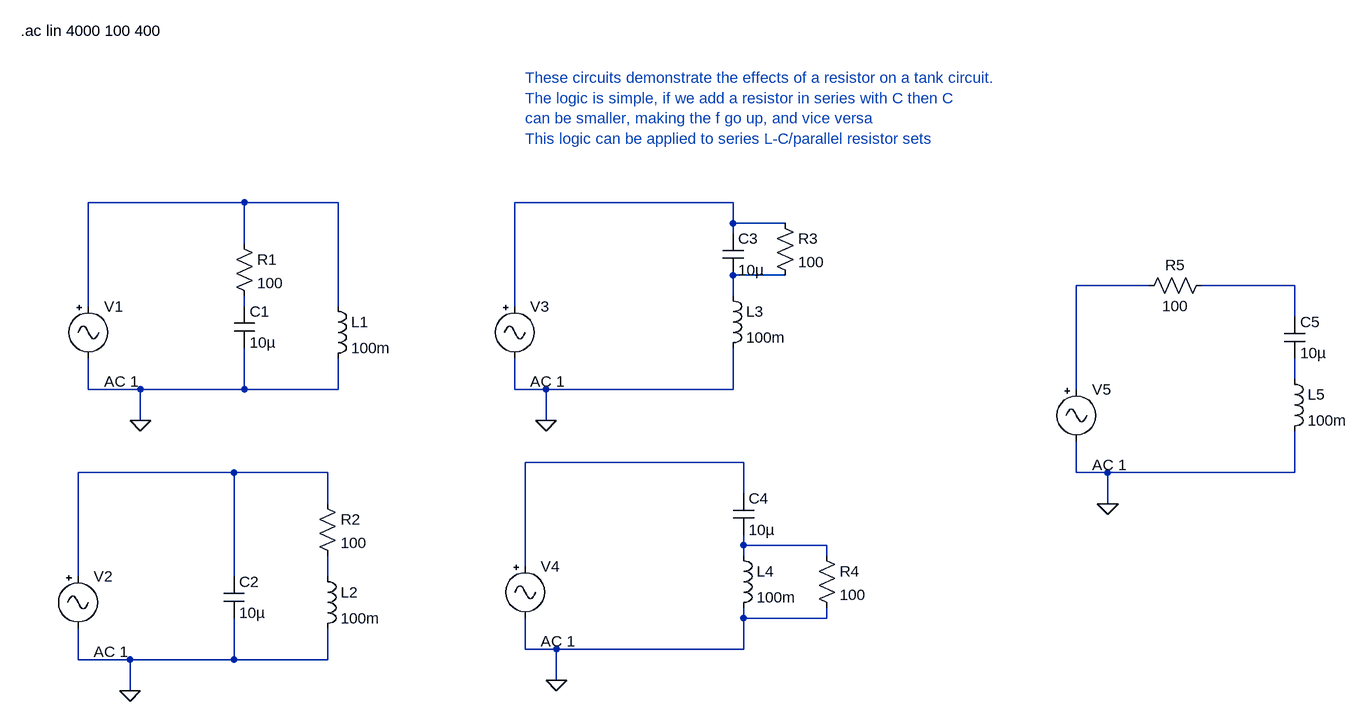
[diagram p0: schematic Antiresonance.asc]
Antiresonance.asc, the LTspice schematic file:
Version 4.1
SHEET 1 2084 724
WIRE 320 -48 80 -48
WIRE 464 -48 320 -48
WIRE 1072 -48 736 -48
WIRE 1072 -16 1072 -48
WIRE 1152 -16 1072 -16
WIRE 1072 0 1072 -16
WIRE 320 16 320 -48
WIRE 1152 64 1072 64
WIRE 1712 80 1600 80
WIRE 1936 80 1792 80
WIRE 1072 96 1072 64
WIRE 80 112 80 -48
WIRE 320 112 320 96
WIRE 464 112 464 -48
WIRE 736 112 736 -48
WIRE 1936 128 1936 80
WIRE 1936 224 1936 192
WIRE 80 240 80 192
WIRE 160 240 80 240
WIRE 320 240 320 176
WIRE 320 240 160 240
WIRE 464 240 464 192
WIRE 464 240 320 240
WIRE 736 240 736 192
WIRE 784 240 736 240
WIRE 1072 240 1072 176
WIRE 1072 240 784 240
WIRE 1600 240 1600 80
WIRE 160 288 160 240
WIRE 784 288 784 240
WIRE 1088 352 752 352
WIRE 304 368 64 368
WIRE 448 368 304 368
WIRE 1600 368 1600 320
WIRE 1648 368 1600 368
WIRE 1936 368 1936 304
WIRE 1936 368 1648 368
WIRE 1088 400 1088 352
WIRE 448 416 448 368
WIRE 1648 416 1648 368
WIRE 1088 480 1088 464
WIRE 1216 480 1088 480
WIRE 1088 496 1088 480
WIRE 1216 496 1216 480
WIRE 752 512 752 352
WIRE 64 528 64 368
WIRE 304 528 304 368
WIRE 448 528 448 496
WIRE 1088 592 1088 576
WIRE 1216 592 1216 576
WIRE 1216 592 1088 592
WIRE 752 640 752 592
WIRE 800 640 752 640
WIRE 1088 640 1088 592
WIRE 1088 640 800 640
WIRE 64 656 64 608
WIRE 144 656 64 656
WIRE 304 656 304 592
WIRE 304 656 144 656
WIRE 448 656 448 608
WIRE 448 656 304 656
WIRE 800 688 800 640
WIRE 144 704 144 656
FLAG 160 288 0
FLAG 144 704 0
FLAG 784 288 0
FLAG 800 688 0
FLAG 1648 416 0
SYMBOL cap 304 112 R0
SYMATTR InstName C1
SYMATTR Value 10µ
SYMBOL ind 448 96 R0
SYMATTR InstName L1
SYMATTR Value 100m
SYMATTR SpiceLine Rser=1u
SYMBOL res 304 0 R0
SYMATTR InstName R1
SYMATTR Value 100
SYMBOL cap 288 528 R0
SYMATTR InstName C2
SYMATTR Value 10µ
SYMATTR SpiceLine Rser=1u
SYMBOL ind 432 512 R0
SYMATTR InstName L2
SYMATTR Value 100m
SYMATTR SpiceLine Rser=0
SYMBOL res 432 400 R0
SYMATTR InstName R2
SYMATTR Value 100
SYMBOL res 1136 -32 R0
SYMATTR InstName R3
SYMATTR Value 100
SYMBOL cap 1056 0 R0
SYMATTR InstName C3
SYMATTR Value 10µ
SYMATTR SpiceLine Rser=1u
SYMBOL ind 1056 80 R0
SYMATTR InstName L3
SYMATTR Value 100m
SYMATTR SpiceLine Rser=1u
SYMBOL res 1200 480 R0
SYMATTR InstName R4
SYMATTR Value 100
SYMBOL ind 1072 480 R0
SYMATTR InstName L4
SYMATTR Value 100m
SYMATTR SpiceLine Rser=1u
SYMBOL cap 1072 400 R0
SYMATTR InstName C4
SYMATTR Value 10µ
SYMATTR SpiceLine Rser=1u
SYMBOL Misc\\signal 80 96 R0
WINDOW 123 24 132 Left 2
WINDOW 39 0 0 Left 0
SYMATTR Value2 AC 1
SYMATTR InstName V1
SYMATTR Value ""
SYMBOL Misc\\signal 64 512 R0
WINDOW 123 24 132 Left 2
WINDOW 39 0 0 Left 0
SYMATTR Value2 AC 1
SYMATTR InstName V2
SYMATTR Value ""
SYMBOL Misc\\signal 736 96 R0
WINDOW 123 24 132 Left 2
WINDOW 39 0 0 Left 0
SYMATTR Value2 AC 1
SYMATTR InstName V3
SYMATTR Value ""
SYMBOL Misc\\signal 752 496 R0
WINDOW 123 24 132 Left 2
WINDOW 39 0 0 Left 0
SYMATTR Value2 AC 1
SYMATTR InstName V4
SYMATTR Value ""
SYMBOL res 1696 96 R270
WINDOW 0 32 56 VTop 2
WINDOW 3 0 56 VBottom 2
SYMATTR InstName R5
SYMATTR Value 100
SYMBOL cap 1920 128 R0
SYMATTR InstName C5
SYMATTR Value 10µ
SYMATTR SpiceLine Rser=1u
SYMBOL ind 1920 208 R0
SYMATTR InstName L5
SYMATTR Value 100m
SYMATTR SpiceLine Rser=1u
SYMBOL Misc\\signal 1600 224 R0
WINDOW 123 24 132 Left 2
WINDOW 39 0 0 Left 0
SYMATTR Value2 AC 1
SYMATTR InstName V5
SYMATTR Value ""
TEXT -24 -312 Left 2 !.ac lin 4000 100 400
TEXT 752 -240 Left 2 ;These circuits demonstrate the effects of a resistor on a tank circuit.\nThe logic is simple, if we add a resistor in series with C then C\ncan be smaller, making the f go up, and vice versa\nThis logic can be applied to series L-C/parallel resistor sets

The netlist it stands for:
* Antiresonance.asc
C1 N006 0 10µ
L1 N001 0 100m Rser=1u
R1 N001 N006 100
C2 N009 0 10µ Rser=1u
L2 N011 0 100m Rser=0
R2 N009 N011 100
R3 N002 N003 100
C3 N002 N003 10µ Rser=1u
L3 N003 0 100m Rser=1u
R4 N010 0 100
L4 N010 0 100m Rser=1u
C4 N008 N010 10µ Rser=1u
V1 N001 0 AC 1
V2 N009 0 AC 1
V3 N002 0 AC 1
V4 N008 0 AC 1
R5 N004 N005 100
C5 N005 N007 10µ Rser=1u
L5 N007 0 100m Rser=1u
V5 N004 0 AC 1
.ac lin 4000 100 400
* These circuits demonstrate the effects of a resistor on a tank circuit.
* The logic is simple, if we add a resistor in series with C then C
* can be smaller, making the f go up, and vice versa
* This logic can be applied to series L-C/parallel resistor sets
.backanno
.end